# EAGLE design WifiLamp_Hardware V2.0 (EAGLE 7.6.0)
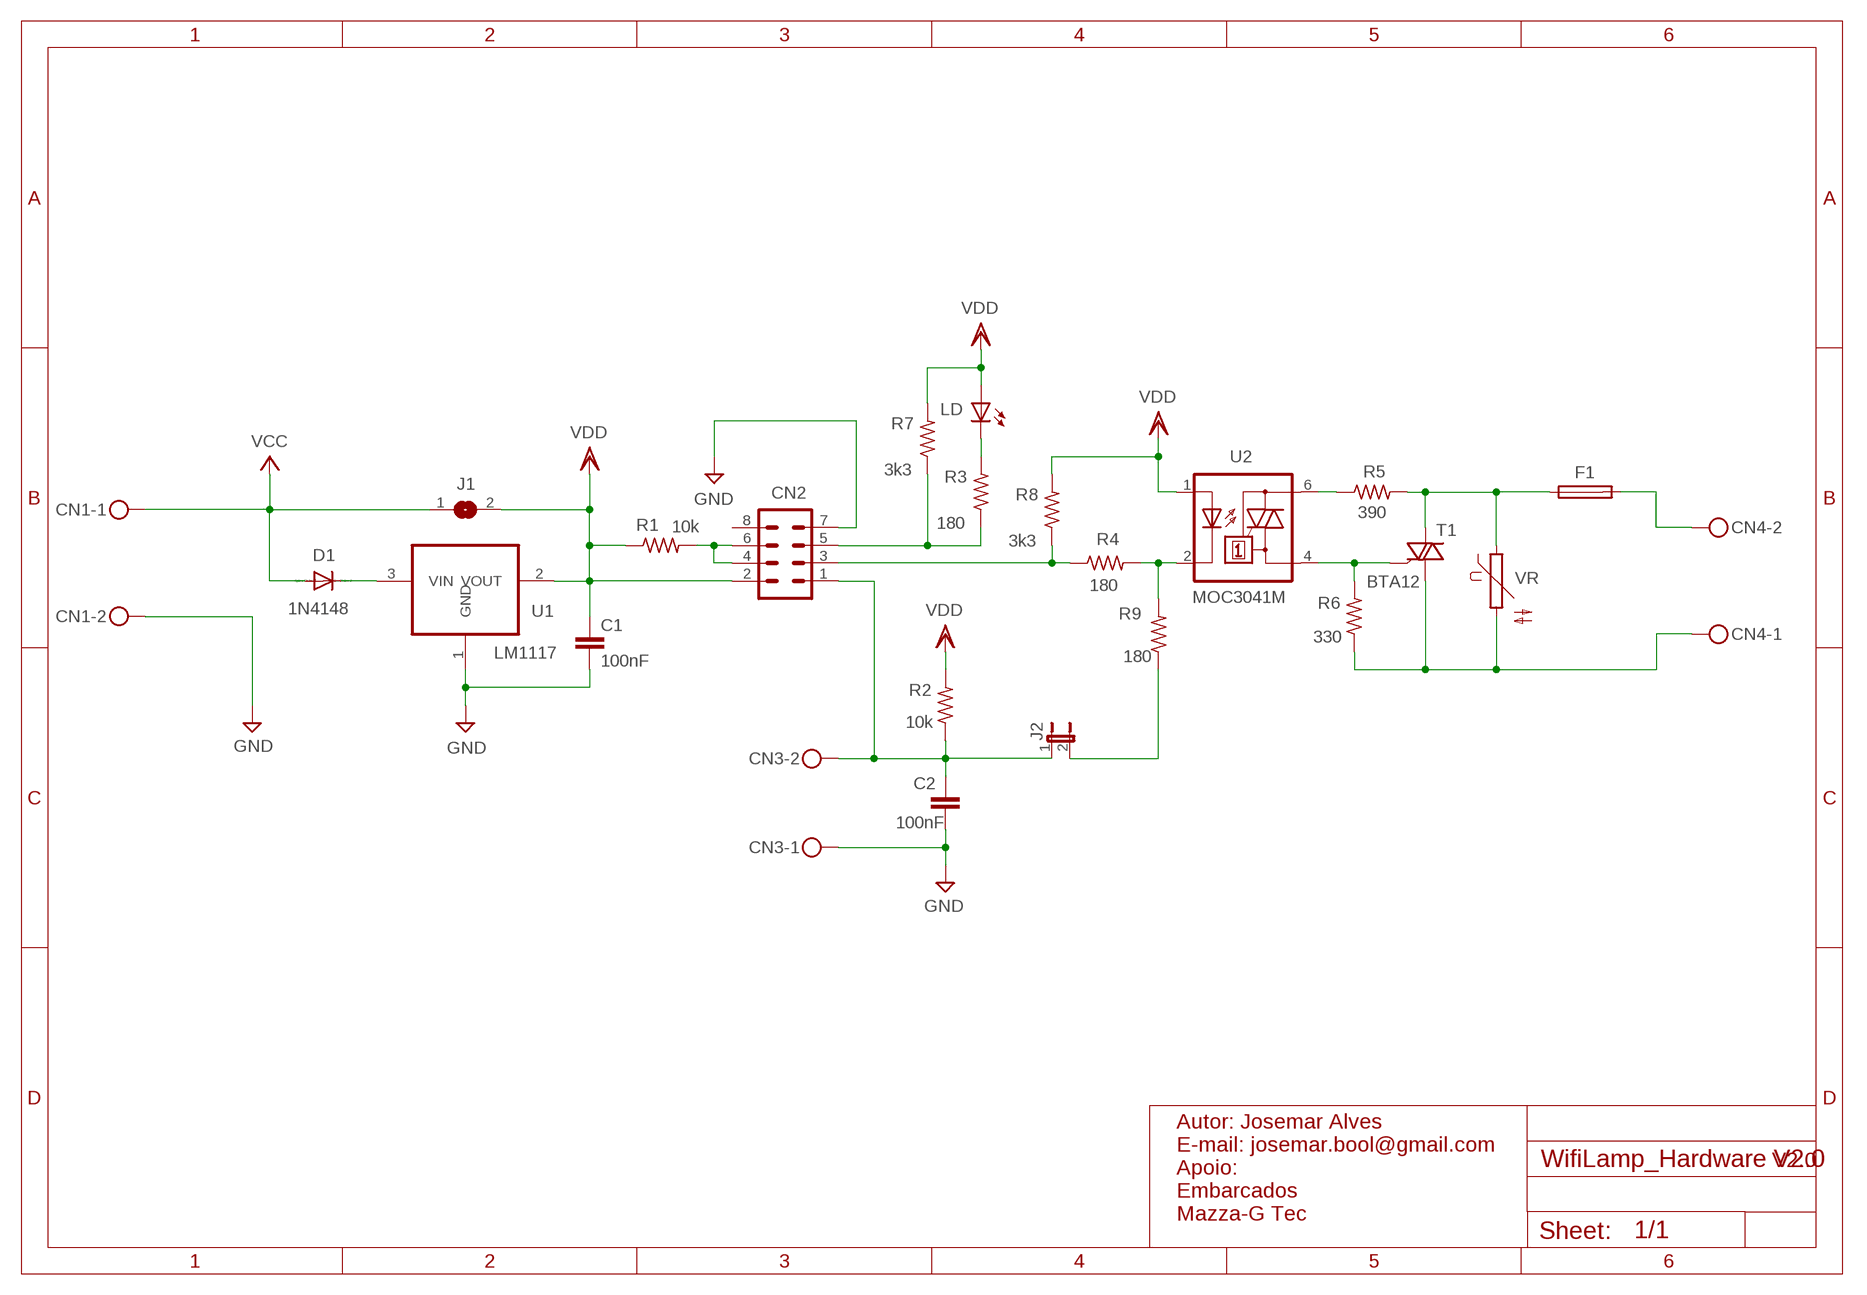
[diagram p0: schematic, sheet 1]

## Parts
C1  100nF  C-EUC0805K  [C0805K]
C2  100nF  C-EUC0805K  [C0805K]
CN1  MKDSN1,5/2-5,08  [MKDSN1,5/2-5,08]
CN2  MA04-2  [MA04-2]
CN3  MKDSN1,5/2-5,08  [MKDSN1,5/2-5,08]
CN4  MKDSN1,5/2-5,08  [MKDSN1,5/2-5,08]
D1  1N4148  DIODE-D-7.5  [D-7.5]
F1  FUSETR5  [TR5]
J1  SJ  [SJ]
J2  JP1E  [JP1]
LD  LED3MM  [LED3MM]
R1  10k  R-US_0309/V  [0309V]
R2  10k  R-US_0309/V  [0309V]
R3  180  R-US_0309/V  [0309V]
R4  180  R-US_0309/V  [0309V]
R5  390  R-US_0309/V  [0309V]
R6  330  R-US_0309/V  [0309V]
R7  3k3  R-US_0309/V  [0309V]
R8  3k3  R-US_0309/V  [0309V]
R9  180  R-US_0309/V  [0309V]
T1  BTA12  BT138-V  [TO220BV]
U1  LM1117  REG1117  [SOT223]
U2  MOC3041M  [DIL06]
VR  S07K230  [S07K230]

## Nets
FS: F1.1 R5.2 T1.T2(A2) VR.1
N$1: R5.1 U2.6(A2)
N$2: R6.2 T1.G U2.4(A1)
N$3: R4.2 R9.2 U2.2(C)
N$5: CN2.3 R4.1 R8.1
N$6: J2.2 R9.1
N$7: CN4.2 F1.2
N$9: D1.C U1.3(VIN)
N$31: CN2.5 R3.1 R7.1
N$50: C2.1 CN2.1 CN3.2 J2.1 R2.1
N$64: LD.K(C) R3.2
N$65: C1.1 CN2.2 J1.2 LD.A R1.1 R2.2 R7.2 R8.2 U1.2(VOUT) U2.1(A) ; supply symbol labelled VDD
N$66: C1.2 C2.2 CN1.2 CN2.7 CN3.1 U1.1(GND) ; supply symbol labelled GND
N$68: CN2.4 CN2.6 R1.2
N$70: CN1.1 D1.A J1.1 ; supply symbol labelled VCC
N$72: CN4.1 R6.1 T1.T1(A1) VR.2
Unconnected: CN2.8

## Notes on the sheet
- V2.0
- Autor: Josemar Alves
  E-mail: josemar.bool@gmail.com
  Apoio:
  Embarcados
  Mazza-G Tec

## Library data of the parts
C1 C2 = rcl:C-EU: CAPACITOR, European symbol
CN1 CN3 CN4 = con-phoenix-508:MKDSN1,5/2-5,08: MKDSN 1,5/ 2-5,08 Printklemme Nennstrom: 13,5 A Nennspannung: 250 V Rastermaß: 5,08 mm Polzahl: 2 Anschlussart: Schraubanschluss Montage: Löten Anschlussrichtung Leiter/Platine: 0 ° Artikelnummer: 1729128 Source: http://eshop.phoenixcontact.com .. 1729128.pdf
CN2 = con-lstb:MA04-2: PIN HEADER; OC_FARNELL: unknown; OC_NEWARK: unknown
D1 = diode:DIODE-: DIODE
F1 = fuse:FUSE: Fuse; OC_FARNELL: unknown; OC_NEWARK: unknown
J1 = jumper:SJ: SMD solder JUMPER
J2 = jumper:JP1E: JUMPER
LD = led:LED: LED OSRAM: - CHIPLED LG R971, LG N971, LY N971, LG Q971, LY Q971, LO R971, LY R971 LH N974, LH R974 LS Q976, LO Q976, LY Q976 LO Q996 - Hyper CHIPLED LW Q18S LB Q993, LB Q99A, LB R99A - SideLED LS A670, LO A670, LY A670, LG A670, LP A670 LB A673, LV A673, LT A673, LW A673 LH A674 LY A675 LS A676, LA A676, LO A676, LY A676, LW A676 LS A679, LY A679, LG A679 - Hyper Micro SIDELED® LS Y876, LA Y876, LO Y876, LY Y876 LT Y87S - SmartLED LW L88C, LW L88S LB L89C, LB L89S, LG L890 LS L89K, LO L89K, LY L89K LS L896, LA L896, LO L896, LY L896 - TOPLED LS T670, LO T670, LY T670, LG T670, LP T670 LSG T670, LSP T670, LSY T670, LOP T670, LYG T670 LG T671, LOG T671, LSG T671 LB T673, LV T673, LT T673, LW T673 LH T674 LS T676, LA T676, LO T676, LY T676, LB T676, LH T676, LSB T676, LW T676 LB T67C, LV T67C, LT T67C, LS T67K, LO T67K, LY T67K, LW E67C LS E67B, LA E67B, LO E67B, LY E67B, LB E67C, LV E67C, LT E67C LW T67C LS T679, LY T679, LG T679 LS T770, LO T770, LY T770, LG T770, LP T770 LB T773, LV T773, LT T773, LW T773 LH T774 LS E675, LA E675, LY E675, LS T675 LS T776, LA T776, LO T776, LY T776, LB T776 LHGB T686 LT T68C, LB T68C - Hyper Mini TOPLED® LB M676 - Mini TOPLED Santana® LG M470 LS M47K, LO M47K, LY M47K Source: http://www.osram.convergy.de LUXEON: - LUMILED® LXK2-PW12-R00, LXK2-PW12-S00, LXK2-PW14-U00, LXK2-PW14-V00 LXK2-PM12-R00, LXK2-PM12-S00, LXK2-PM14-U00 LXK2-PE12-Q00, LXK2-PE12-R00, LXK2-PE12-S00, LXK2-PE14-T00, LXK2-PE14-U00 LXK2-PB12-K00, LXK2-PB12-L00, LXK2-PB12-M00, LXK2-PB14-N00, LXK2-PB14-P00, LXK2-PB14-Q00 LXK2-PR12-L00, LXK2-PR12-M00, LXK2-PR14-Q00, LXK2-PR14-R00 LXK2-PD12-Q00, LXK2-PD12-R00, LXK2-PD12-S00 LXK2-PH12-R00, LXK2-PH12-S00 LXK2-PL12-P00, LXK2-PL12-Q00, LXK2-PL12-R00 Source: www.luxeon.com KINGBRIGHT: KA-3528ASYC Source: www.kingbright.com
R1-R9 = resistor:R-US_: RESISTOR, American symbol
T1 = triac:BT138: TRIAC Source: http://www.semiconductors.philips.com BT138_SERIES_2.pdf
U1 = burr-brown:REG1117: 800mA and 1A Low Dropout (LDO) Positive Regulator 1.8V, 2.5V, 2.85V, 3.3V, 5V, and Adj; MPN: REG1117; OC_FARNELL: 1097566; OC_NEWARK: 14P6981
U2 = optocoupler:MOC30*: 6-Pin DIP Zero-Cross Optoisolators Triac Driver Output (250/400 Volt Peak) Source: Data sheet <http://www.fairchildsemi.com/ds/MO/MOC3031M.pdf> The old path of data sheet not more available 2013-05-06.; MF: FAIRCHILD SEMICONDUCTOR; MPN: MOC3041M; OC_FARNELL: 1086677; OC_NEWARK: 78K6090
VR = varistor:S07K230: VARISTOR

## Board
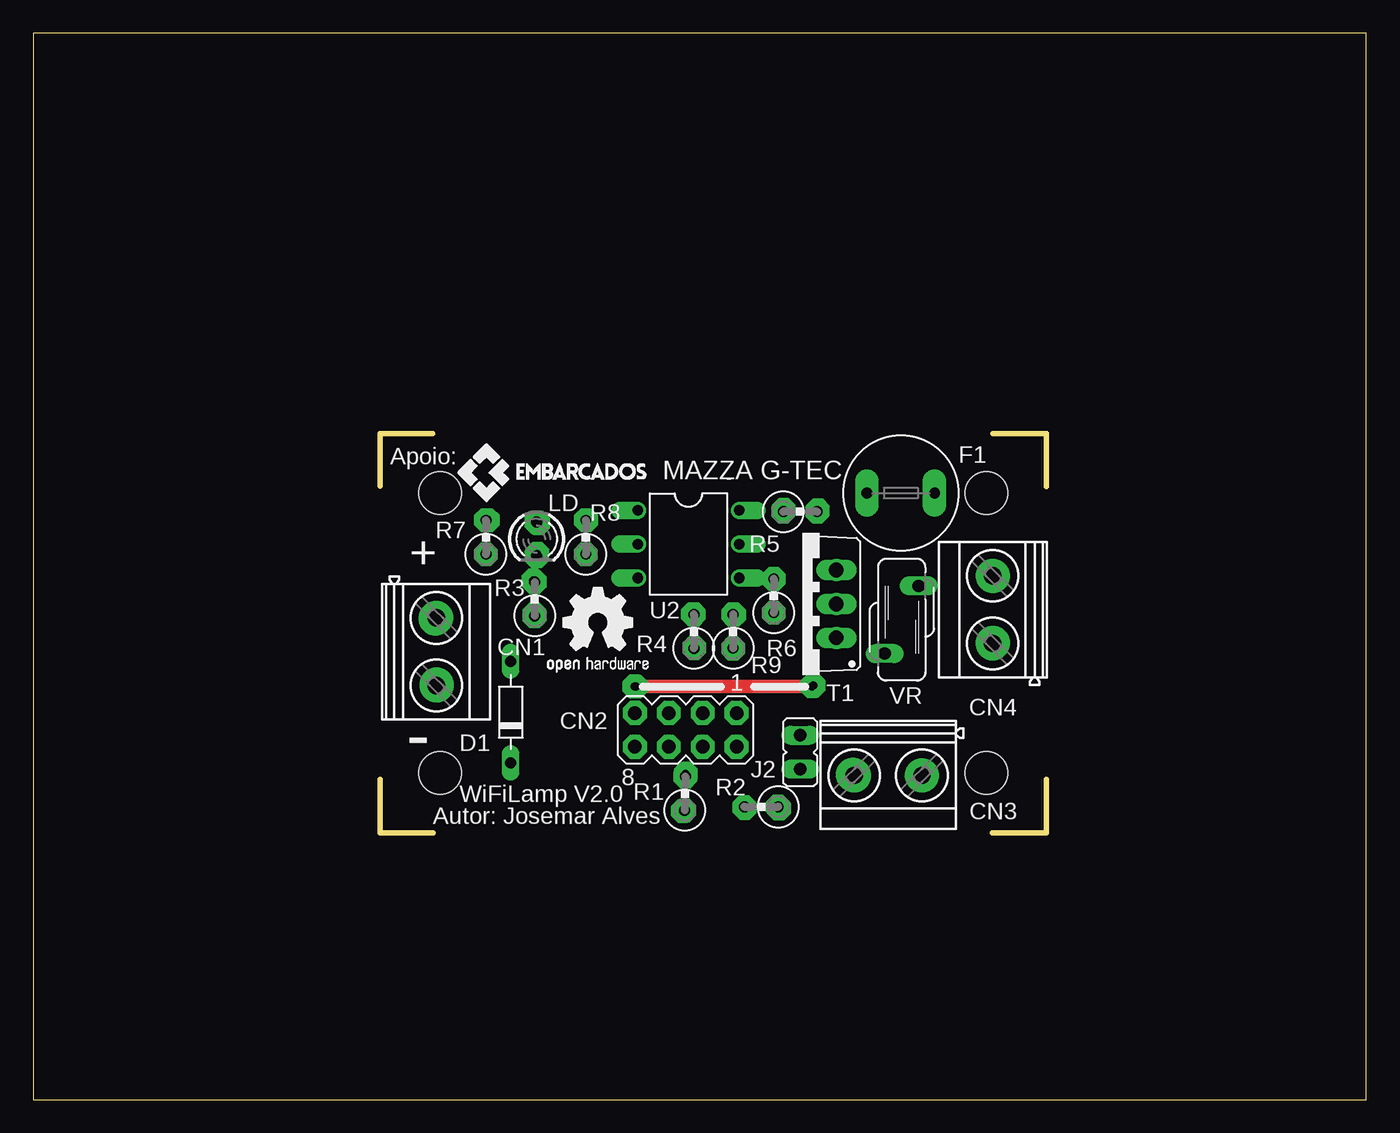
[diagram p1: board, top side]
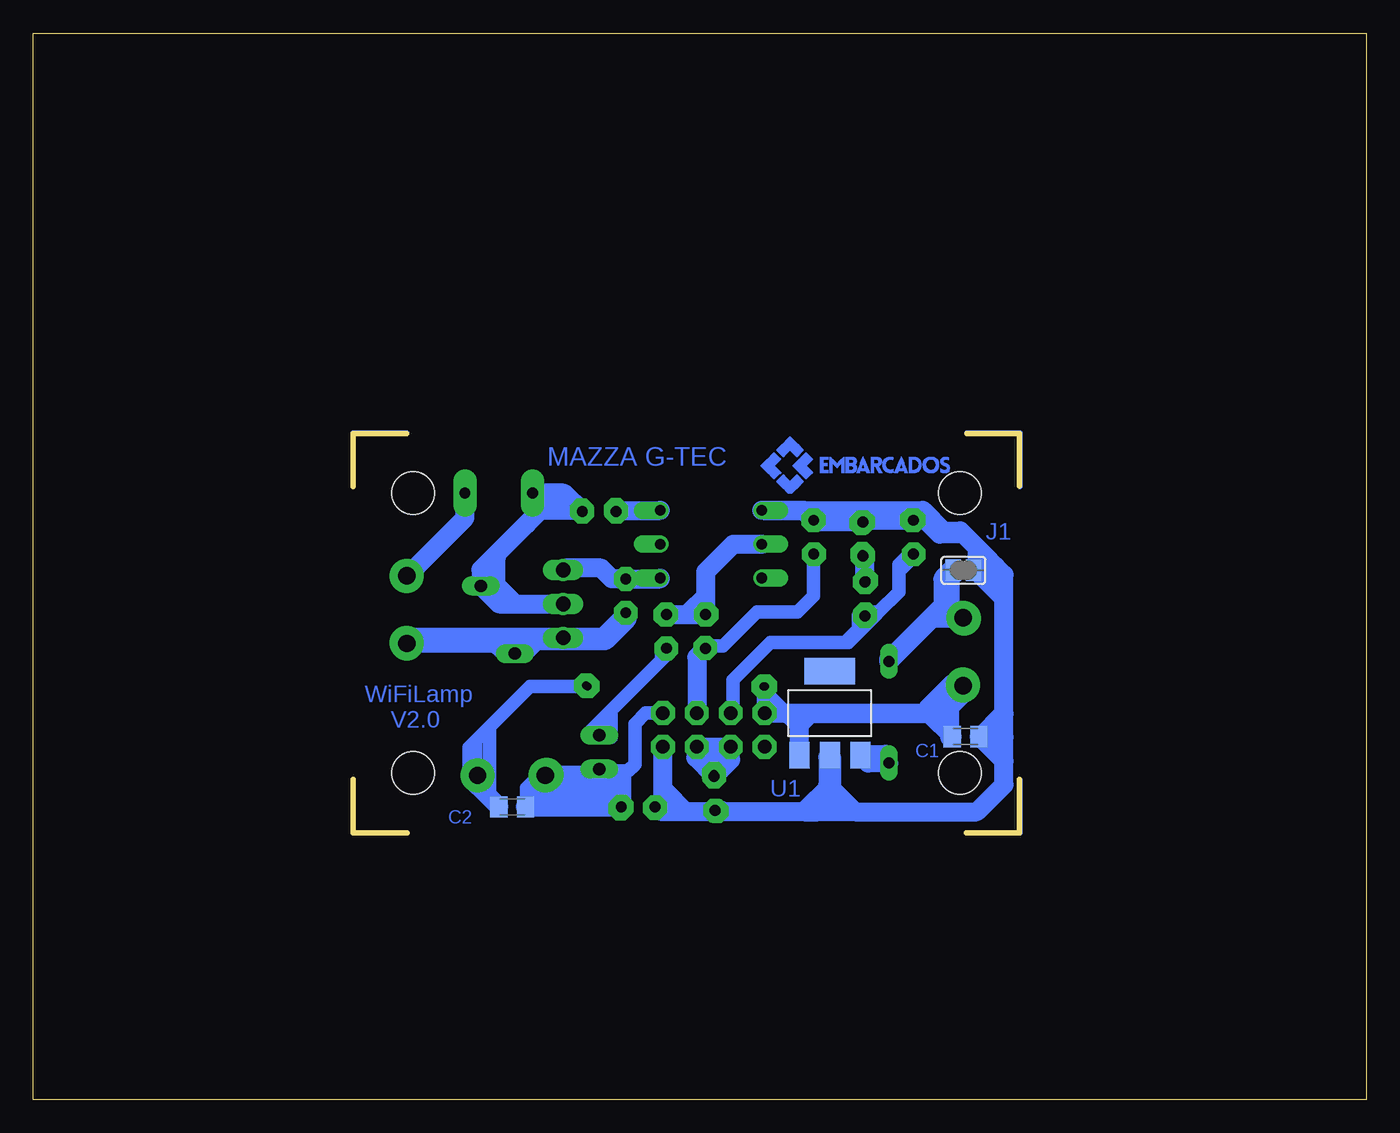
[diagram p2: board, bottom side, seen from below]

Size 100 x 80 mm. Coordinates in mm from the lower left corner, seen from the top.
Outline: 26.01,46.02 26.01,49.99 29.95,49.99
Outline: 26.01,24 26.01,19.99 30,19.99
Outline: 71.96,20.02 76,20.02 76,24
Outline: 71.98,49.99 76,49.99 76,46
Outline: 0,0 100,0 100,80 0,80 0,0
Copper layers (1*16): Top 0.035mm / dielectric 1.5mm / Bottom 0.035mm
Design rules "default": minimum track width 10mil, minimum drill 24mil, track to track 8mil, track to pad 8mil, pad to pad 8mil, via to via 8mil, smd to smd 8mil, copper to edge 40mil, drill to drill 8mil, minimum pad ring 10mil, minimum via ring 8mil, stop-mask expansion 4mil, vias tented up to drill 0mil, thermal gap 10mil
Holes 3.2 mm at 30.5,24.5 30.5,45.5 71.5,45.5 71.5,24.5

### Footprints (pad centres in the part's own frame; a part is rotated, then mirrored left to right if it is on the bottom)
C0805K = smd 1.3 x 1.6: 1 -1,0; 2 1,0
MKDSN1,5/2-5,08 = drill 1.3 pad 2: 1 -2.561,0.025; 2 2.519,0.025
MA04-2 = drill 1.016 octagon: 1 -3.81,-1.27; 2 -3.81,1.27; 3 -1.27,-1.27; 4 -1.27,1.27; 5 1.27,-1.27; 6 1.27,1.27; 7 3.81,-1.27; 8 3.81,1.27
D-7.5 = drill 0.813 long: A 3.81,0; C -3.81,0
TR5 = drill 0.813 pad 1.778 long: 1 -2.54,0; 2 2.54,0
SJ = smd 1.168 x 1.6: 1 -0.762,0; 2 0.762,0
JP1 = drill 0.914 long: 1 0,-1.27; 2 0,1.27
LED3MM = drill 0.813 octagon: A -1.27,0; K 1.27,0
0309V = drill 0.813 octagon: 1 -1.27,0; 2 1.27,0
TO220BV = drill 1.016 long: G 2.54,-2.54; T1 -2.54,-2.54; T2 0,-2.54
SOT223 = smd 1.499 x 2.007: 1 -2.261,-3.15; 2 0.025,-3.15; 3 2.311,-3.15 | smd 3.81 x 2.007: 4 0,3.15
DIL06 = drill 0.813 offset: 1 -2.54,-3.81; 2 0,-3.81; 3 2.54,-3.81; 4 2.54,3.81; 5 0,3.81; 6 -2.54,3.81
S07K230 = drill 0.914 long: 1 -1.27,-2.54; 2 1.27,2.54

### Placement (x,y rotation side)
C1  30.06,27.23 180 bottom
C2  64.07,21.96 180 bottom
CN1  30.21,33.58 270 top
CN2  48.95,27.73 180 top
CN3  64.11,24.35 180 top
CN4  72,36.78 90 top
D1  35.82,29.06 90 top
F1  65.08,45.5 0 top
J1  30.22,39.71 0 bottom
J2  57.53,26.06 0 top
LD  37.76,42.05 270 top
R1  48.89,22.97 88.7 top
R2  54.61,21.96 180 top
R3  37.62,37.56 90 top
R4  49.56,35.12 90 top
R5  57.54,44.11 0 top
R6  55.55,37.8 90 top
R7  33.96,42.19 90 top
R8  41.45,42.19 90 top
R9  52.5,35.13 90 top
T1  57.71,37.18 90 top
U1  40.25,28.99 0 bottom
U2  49.16,41.67 270 top
VR  65.15,36 180 top

### Tracks (layer width: path | path; a pad name or v marks a point on that pad's centre or on a via)
FS
  Bottom 1.422: T1.T2 65.06,37.18 VR.1 66.42,39.75 62.99,43.18 62.48,43.69 | 62.48,44.2 62.48,45.44 F1.1 60.2,45.5 R5.2 | 62.48,44.2 62.48,43.69 | 58.93,44.2 62.48,44.2 | 62.48,43.69 62.23,43.94
N$1
  Bottom 1.422: R5.1 56.18,44.21 U2.6
N$2
  Bottom 1.422: 60.15,39.83 T1.G 60.1,39.88 57.4,39.88 56.59,39.07 R6.2 52.97,39.07 U2.4
N$3
  Bottom 1.422: U2.2 45.36,41.66 47.5,41.66 49.56,39.59 R4.2 R9.2
N$4
  Bottom 1.422: 31.24,27.18 31.24,29.46 29.97,30.73 29.97,31.24 30.99,30.23
N$5
  Bottom 1.016: R4.1 49.38,34.04 48.26,34.04 45.72,36.58 42.67,36.58 41.45,37.8 R8.1
  Bottom 1.422: R4.1 50.22,33.2 CN2.3
N$6
  Bottom 1.016: J2.2 57.4,27.46 57.4,28.45 | 57.4,28.45 56.64,29.21 | 56.64,29.21 52.5,33.35 R9.1 | 56.64,27.18 56.64,29.21 | 58.42,27.43 57.4,28.45
N$7
  Bottom 1.422: CN4.2 67.62,43.65 F1.2
N$8
  Bottom 1.016: 52.88,33.02 52.88,33.93
N$9
  Bottom 1.422: D1.C 37.36,25.25 U1.3
N$10  (via drill 0.6 pad 1.78)
  other vias: 58.86,44.2
N$11  (via drill 0.6 pad 1.78)
  other vias: 55.94,21.85
N$12
  Bottom 0.406: 26,24 26,20 30,20
N$13
  Bottom 1.422: 37.59,25.91 36.07,25.91
N$14
  Bottom 0.406: 26,46 26,50 29.95,50
N$15
  Bottom 0.406: 72,50 76,50 76,46
N$16
  Bottom 0.406: 72,20 76,20 76,24
N$17
  Bottom 1.422: 31.24,39.37 31.24,37.59 | 31.24,37.59 31.24,36.32 | 35.81,33.02 31.24,37.59
N$26  (via drill 0.6 pad 1.78)
  other vias: 53.38,21.89
N$29  (via drill 0.6 pad 1.78)
  other vias: 52.58,36.37
N$31
  Bottom 1.016: 34.04,40.64 35.05,39.62 | 36.83,36.32 37.59,36.32 R3.1 37.62,35.79 39.12,34.29 | 36.83,36.32 36.58,36.58 | 36.58,36.58 35.05,38.1 35.05,39.62 | 35.05,39.62 35.05,40.13 34.27,40.92 R7.1 | CN2.5 47.5,29.18 47.5,31.5 44.7,34.29 39.12,34.29 | 39.12,34.29 38.86,34.29 38.1,35.05 | 38.1,35.05 36.83,36.32 | 36.58,36.58 37.85,36.58 38.1,36.32 38.1,35.05
N$33  (via drill 0.6 pad 1.78)
  other vias: 48.73,21.63
N$34  (via drill 0.6 pad 1.78)
  other vias: 37.59,36.41
N$36  (via drill 0.6 pad 1.78)
  other vias: 49.49,36.41
N$37  (via drill 0.6 pad 1.78)
  other vias: 37.51,38.95
N$38  (via drill 0.6 pad 1.78)
  other vias: 48.94,24.43
N$39  (via drill 0.6 pad 1.78)
  other vias: 58.42,31.01 53.34,21.91 48.85,21.68 52.76,26.46 50.22,26.46 47.68,26.46 45.14,26.46 45.14,26.46 45.14,29 47.68,29 50.22,29 52.76,29 48.92,24.22 52.5,33.85 49.58,33.88 49.56,36.39 52.5,36.39 55.55,39.06 55.55,36.52 56.26,44.11
N$40  (via drill 0.6 pad 1.78)
  other vias: 45.21,30.98
N$43  (via drill 0.6 pad 1.78)
  other vias: 58.54,31.07
N$45  (via drill 0.6 pad 1.78)
  other vias: 45.11,30.99
N$49  (via drill 0.6 pad 1.78)
  other vias: 34.07,43.47
N$50
  Bottom 1.016: J2.1 57.38,24.64 55.63,24.64 | 55.63,24.64 55.37,24.64 | 55.37,24.64 54.86,25.15 54.86,28.19 54.06,29 CN2.1 | 55.37,24.64 56.9,23.11 | 55.63,21.84 55.63,24.64
  Bottom 1.422: CN3.2 58,24.32 J2.1 57.53,23.61 R2.1 C2.1
N$51  (via drill 0.6 pad 1.78)
  other vias: 37.88,43.26
N$52  (via drill 0.6 pad 1.78)
  other vias: 56.3,44.23 37.6,36.28 37.6,38.82 41.44,40.91 41.46,43.47 37.76,40.78 33.95,40.91 37.76,40.78 37.76,43.32 33.97,43.47
N$53  (via drill 0.6 pad 2.54)
  other vias: 30.25,31.15
N$54  (via drill 0.6 pad 2.54)
  other vias: 30.16,36.1 30.24,36.15
N$56  (via drill 0.6 pad 2.54)
  other vias: 72,39.28 71.97,39.3
N$58  (via drill 0.6 pad 2.54)
  other vias: 72,34.28 61.59,24.32 66.67,24.32 71.97,34.23
N$60  (via drill 0.6 pad 1.78)
  other vias: 37.81,40.95 55.87,21.95 58.81,44.1
N$64
  Bottom 1.422: R3.2 37.62,40.64 LD.K
N$65
  Bottom 1.27: J1.2 29.17,40.01 27.81,40.01
  Bottom 1.422: 45.21,44.2 33.27,44.2 31.75,42.67 30.48,42.67 30.23,42.42 | 38.35,21.59 40.39,23.62 40.39,25.68 U1.2 40.13,25.74 40.13,23.62 42.16,21.59 | 38.35,21.59 29.21,21.59 27.18,23.62 27.18,25.4 | 27.18,25.4 27.18,27.18 | 27.18,27.18 27.18,28.96 | 27.18,28.96 27.18,39.37 27.81,40.01 28.57,40.77 | 42.16,21.59 48.26,21.59 | 48.26,21.59 48.37,21.7 R1.1 48.98,21.59 51.05,21.59 52.58,23.11 | 52.58,23.11 52.76,22.28 CN2.2 | R2.2 52.58,22.72 52.58,23.11 | 28.57,40.77 29.21,41.4 | 29.21,41.4 30.23,42.42 | 30.23,42.42 32,42.42 33.05,43.46 R7.2 37.62,43.46 LD.A 41.32,43.32 R8.2 42.2,44.21 U2.1 | 28.57,40.6 28.57,40.77 | C1.1 29,27.18 28.96,27.18 | 28.96,27.18 27.18,27.18 | 28.96,27.18 27.18,25.4 | 28.96,27.18 27.18,28.96 | 38.35,21.59 41.15,21.59 | 42.16,21.59 41.15,21.59 | 41.15,21.59 39.88,22.86 | 29.21,41.4 29.21,39.62 27.43,37.85 | 48.26,21.59 52.83,21.59 53.09,21.84 53.09,22.1
N$66  (via drill 0.6)
  Top 1.016: v45.21,30.99 v58.42,30.99
  Bottom 1.016: 43.94,29.21 42.67,27.94 42.42,27.94 41.4,28.96 | CN2.7 45.21,29.07 v45.21,30.99 45.21,30.73 43.69,29.21 | v58.42,30.99 62.74,30.99 65.79,27.94 | 65.79,27.94 66.8,26.92 | 66.8,26.92 66.8,24.45 CN3.1 | 65.79,27.94 65.79,23.11 | 66.8,26.92 67.31,26.42 67.31,23.88 66.8,23.37
  Bottom 1.422: U1.1 42.52,28.35 41.91,28.96 41.4,28.96 32.34,28.96 CN1.2 30.41,31.24 30.99,31.24 32.64,29.59 | CN2.7 33.23,29 32.64,29.59 | C2.2 66.67,23.56 CN3.1 | C1.2 32.64,28.82 32.64,29.59
N$68
  Bottom 1.422: CN2.6 47.68,25.48 R1.2 48.92,24.29 50.29,25.65 50.29,26.39 CN2.4
N$69
  Bottom 1.016: 57.91,24.13 56.39,24.13
N$70
  Bottom 1.27: J1.1 31.75,38.95
  Bottom 1.422: D1.A 32.55,36.14 31.75,36.14 | 31.75,36.14 CN1.1 | 31.75,36.14 31.75,38.35 31.75,38.95 31.75,39.12 31.24,39.62
N$71
  Bottom 1.016: 61.98,24.38 62.99,23.37 62.99,22.35
N$72
  Bottom 1.422: T1.T1 62.7,34.64 VR.2 64.36,33.94 64.64,34.22 CN4.1 | 55.55,36.14 R6.1
  Bottom 1.676: 55.55,36.14 57.15,34.54 63.75,34.54 64.36,33.94
N$75
  Bottom 1.422: 57.15,23.11 62.48,23.11
N$76
  Bottom 1.016: 51.05,36.58 49.53,38.1
N$78
  Bottom 1.422: 65.28,37.59 65.28,40.64
N$84
  Bottom 1.422: 64.01,37.34 65.53,38.86
N$85
  Bottom 1.676: 60.45,34.54 71.63,34.54 71.88,34.29
N$86
  Bottom 0.813: 62.99,33.27 62.23,34.04 62.23,34.29
N$87
  Bottom 0.813: 64.77,33.27 65.53,34.04
N$89
  Bottom 1.422: 47.75,26.42 50.04,26.42 49.02,25.4 48.01,25.4
N$90  (via drill 0.6 pad 2.54)
  other vias: 61.49,24.37 30.25,31.08
N$93  (via drill 1.1 pad 1.42)
  other vias: 60.25,37.19
N$94  (via drill 1.1 pad 1.42)
  other vias: 60.25,39.73
N$95  (via drill 1.1 pad 1.42)
  other vias: 60.25,34.65
(copper drawn outside any net)
  shapes: Bottom area x700

### Text on the board
Bottom: MAZZA G-TEC | WiFiLamp / V2.0
tNames: Apoio: | MAZZA G-TEC | + | - | WiFiLamp V2.0 | Autor: Josemar Alves
_Bottom: C2 | J1 | C1 | U1
_tNames: CN3 | R4 | R5 | U2 | F1 | CN4 | VR | T1 | R3 | D1 | CN1 | CN2 | LD | R6 | R1 | R2